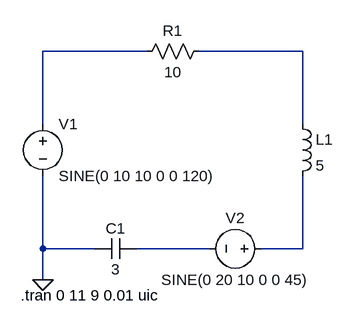
[diagram p0: schematic Klades piemers.asc]
Klades piemers.asc, the LTspice schematic file:
Version 4
SHEET 1 880 680
WIRE 208 16 48 16
WIRE 448 16 288 16
WIRE 48 128 48 16
WIRE 448 128 448 16
WIRE 48 320 48 208
WIRE 128 320 48 320
WIRE 304 320 192 320
WIRE 448 320 448 208
WIRE 448 320 384 320
WIRE 48 368 48 320
FLAG 48 368 0
SYMBOL voltage 48 112 R0
WINDOW 123 0 0 Left 0
WINDOW 39 0 0 Left 0
SYMATTR InstName V1
SYMATTR Value SINE(0 10 10 0 0 120)
SYMBOL voltage 400 320 R90
WINDOW 0 -32 56 VBottom 2
WINDOW 3 32 56 VTop 2
WINDOW 123 0 0 Left 0
WINDOW 39 0 0 Left 0
SYMATTR InstName V2
SYMATTR Value SINE(0 20 10 0 0 45)
SYMBOL ind 432 112 R0
SYMATTR InstName L1
SYMATTR Value 5
SYMATTR SpiceLine Rser=0
SYMBOL cap 128 304 M90
WINDOW 0 0 32 VBottom 2
WINDOW 3 32 32 VTop 2
SYMATTR InstName C1
SYMATTR Value 3
SYMBOL res 304 0 R90
WINDOW 0 0 56 VBottom 2
WINDOW 3 32 56 VTop 2
SYMATTR InstName R1
SYMATTR Value 10
TEXT 14 392 Left 2 !.tran 0 11 9 0.01 uic

The netlist it stands for:
* Klades piemers.asc
V1 N001 0 SINE(0 10 10 0 0 120)
V2 N004 N003 SINE(0 20 10 0 0 45)
L1 N002 N004 5 Rser=0
C1 0 N003 3
R1 N002 N001 10
.tran 0 11 9 0.01 uic
.backanno
.end